# EAGLE design OLED_Board (EAGLE 7.5.0)

## Sheet 1 of 2
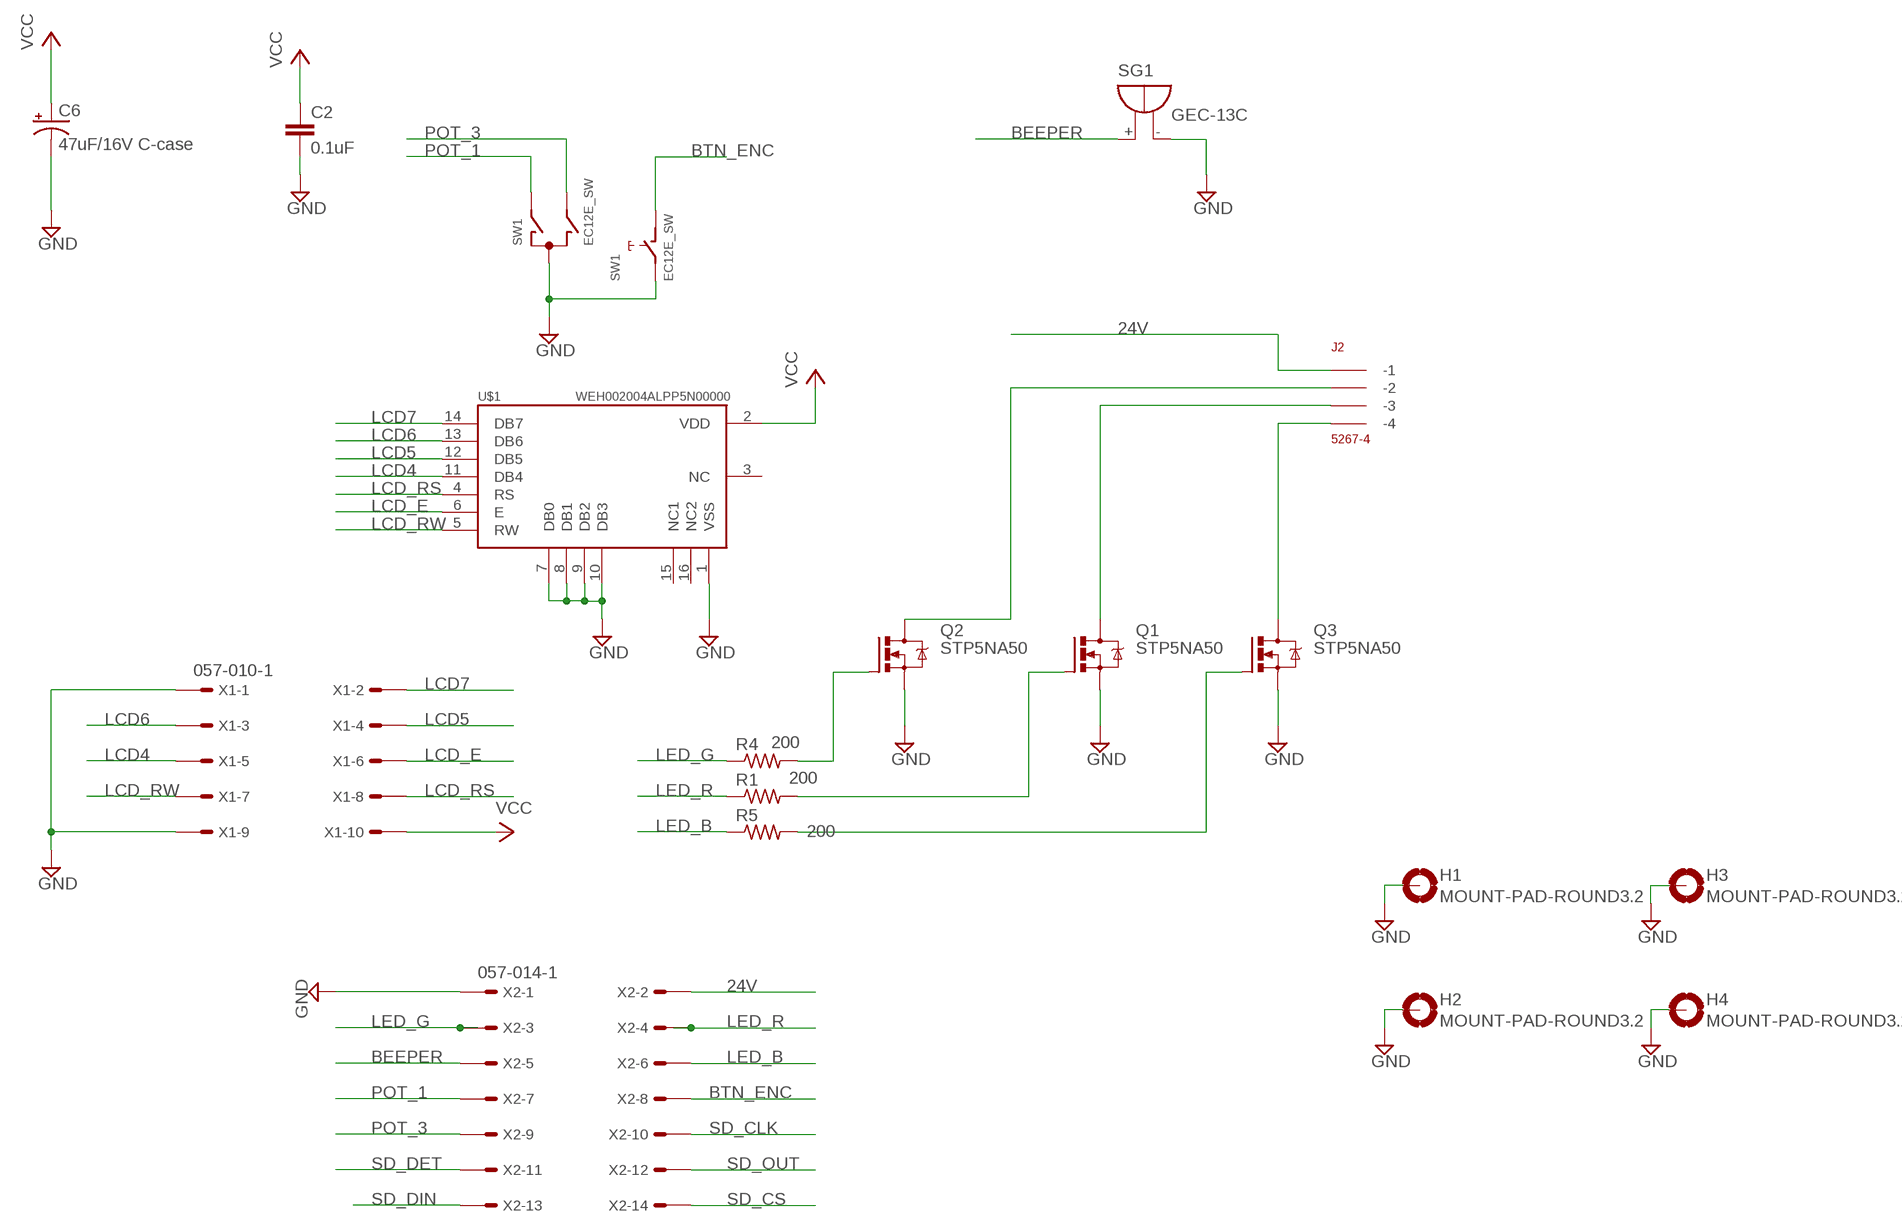
[diagram p0: schematic, sheet 1]

### Parts
C2  0.1uF  C-EUC0805  [C0805]
C6  47uF/16V C-case  CAP_POL6032  [EIA6032]
H1  MOUNT-PAD-ROUND3.2  [3,2-PAD]
H2  MOUNT-PAD-ROUND3.2  [3,2-PAD]
H3  MOUNT-PAD-ROUND3.2  [3,2-PAD]
H4  MOUNT-PAD-ROUND3.2  [3,2-PAD]
J2  5267-4  [5267-4]
Q1  STP5NA50  [TO220BV]
Q2  STP5NA50  [TO220BV]
Q3  STP5NA50  [TO220BV]
R1  200  R-US_R2012  [R2012]
R4  200  R-US_R2012  [R2012]
R5  200  R-US_R2012  [R2012]
SG1  GEC-13C  F/TMB  [F/TMB]
SW1  EC12E_SW  [ALPS_EC12E_SW]
U$1  OLED  [WEH002004ALPP5N00000]
X1  057-010-1  [057-010-1]
X2  057-014-1  [057-014-1]

### Nets
24V: J2.P$1(-1) X2.2
BEEPER: SG1.+ X2.5
BTN_ENC: SW1.D X2.8
GND: C2.2 C6.P$2(-) H1.B3,2(MOUNT) H2.B3,2(MOUNT) H3.B3,2(MOUNT) H4.B3,2(MOUNT) Q1.S Q2.S Q3.S SG1.- SW1.C SW1.E U$1.1(VSS) U$1.7(DB0) U$1.8(DB1) U$1.9(DB2) U$1.10(DB3) X1.1 X1.9 X2.1 ; also sheet 2
LCD4: U$1.11(DB4) X1.5
LCD5: U$1.12(DB5) X1.4
LCD6: U$1.13(DB6) X1.3
LCD7: U$1.14(DB7) X1.2
LCD_E: U$1.6(E) X1.6
LCD_RS: U$1.4(RS) X1.8
LCD_RW: U$1.5(RW) X1.7
LED_B: R5.1 X2.6
LED_G: R4.1 X2.3
LED_R: R1.1 X2.4
N$4: Q2.G R4.2
N$5: Q1.G R1.2
N$6: Q3.G R5.2
N$7: J2.P$2(-2) Q2.D
N$8: J2.P$3(-3) Q1.D
N$9: J2.P$4(-4) Q3.D
POT_1: SW1.A X2.7
POT_3: SW1.B X2.9
SD_CLK: X2.10 ; also sheet 2
SD_CS: X2.14 ; also sheet 2
SD_DET: X2.11 ; also sheet 2
SD_DIN: X2.13 ; also sheet 2
SD_OUT: X2.12 ; also sheet 2
VCC: C2.1 C6.P$1(+) U$1.2(VDD) X1.10 ; also sheet 2
Unconnected: SW1.GND1(G) SW1.GND2(G) U$1.3(NC) U$1.15(NC1) U$1.16(NC2)

## Sheet 2 of 2
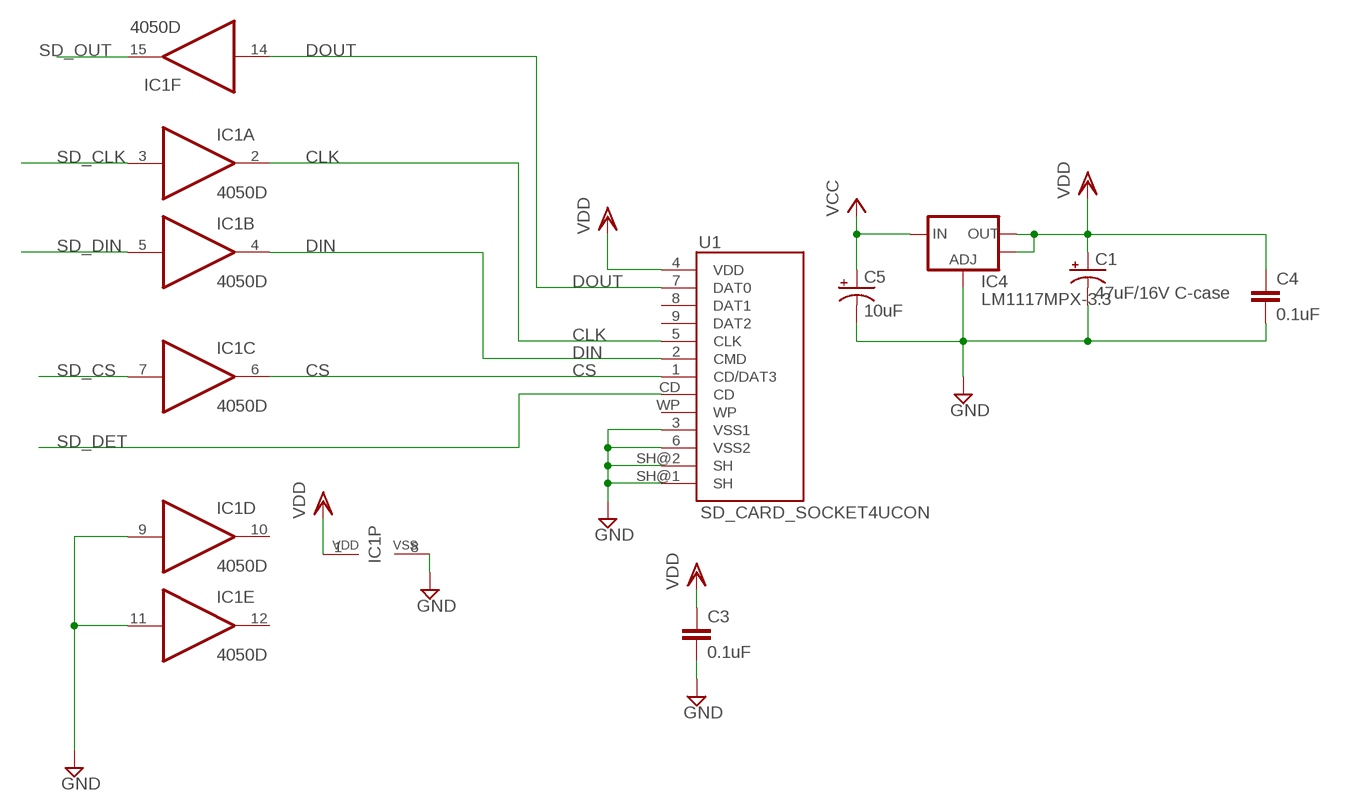
[diagram p1: schematic, sheet 2]

### Parts
C1  47uF/16V C-case  CAP_POL6032  [EIA6032]
C3  0.1uF  C-EUC0805  [C0805]
C4  0.1uF  C-EUC0805  [C0805]
C5  10uF  CPOL-USCT3216  [CT3216]
IC1  4050D  [SO16]
IC4  LM1117MPX-3.3  V_REG_LM1117SOT223  [SOT223]
U1  SD_CARD_SOCKET4UCON  [SDCARD_4UCONN]

### Nets
CLK: IC1.2(A:O) U1.5(CLK)
CS: IC1.6(C:O) U1.1(CD/DAT3)
DIN: IC1.4(B:O) U1.2(CMD)
DOUT: IC1.14(F:I) U1.7(DAT0)
GND: C1.P$2(-) C3.2 C4.2 C5.- IC1.8(P:VSS) IC1.9(D:I) IC1.11(E:I) IC4.1(ADJ) U1.3(VSS1) U1.6(VSS2) U1.SH@1(SH) U1.SH@2(SH) ; also sheet 1
SD_CLK: IC1.3(A:I) ; also sheet 1
SD_CS: IC1.7(C:I) ; also sheet 1
SD_DET: U1.CD ; also sheet 1
SD_DIN: IC1.5(B:I) ; also sheet 1
SD_OUT: IC1.15(F:O) ; also sheet 1
VCC: C5.+ IC4.3(IN) ; also sheet 1
VDD: C1.P$1(+) C3.1 C4.1 IC1.1(P:VDD) IC4.2(OUT) IC4.4(OUT) U1.4(VDD)
Unconnected: IC1.10(D:O) IC1.12(E:O) U1.8(DAT1) U1.9(DAT2) U1.WP

## Library data of the parts
C1 C6 = SparkFun:CAP_POL: Capacitor Polarized These are standard SMD and PTH capacitors. Normally 10uF, 47uF, and 100uF in electrolytic and tantalum varieties. Always verify the external diameter of the through hole cap, it varies with capacity, voltage, and manufacturer. The EIA devices should be standard.
C2 = rcl:C-EU: CAPACITOR, European symbol
C3 C4 = resistor:C-EU: CAPACITOR, European symbol
C5 = resistor:CPOL-US: POLARIZED CAPACITOR, American symbol
H1-H4 = holes:MOUNT-PAD-ROUND: MOUNTING PAD, round
IC1 = 40xx:4050: Hex non-inverting BUFFER
IC4 = SparkFun:V_REG_LM1117: Voltage Regulator LM1117 Standard adjustable voltage regulator but in SMD form. Spark Fun Electronics SKU : COM-00595
J2 = con-molex-spox:5267-4
Q1-Q3 = transistor-power:STP5NA50: N-CHANNEL MOS FET
R1 R4 R5 = rcl:R-US_: RESISTOR, American symbol
SG1 = buzzer:F/TMB: BUZZER Source: Buerklin; OC_FARNELL: unknown; OC_NEWARK: unknown
SW1 = switch-alps:EC12E_SW: ALPS rotary Encoder EC12E series with switch; MPN: EC12E2424407; OC_FARNELL: 1520813; OC_NEWARK: 74M1068
U1 = SparkFun-Connectors:SD_CARD_SOCKET: SD Memory Card Connector, push-push normal type, CD enable, WP enable
U$1 = OLED:OLED
X1 = con-panduit:057-010-: CONNECTOR 10-pin series 057 contact pc board low profile headers; OC_FARNELL: unknown; OC_NEWARK: unknown
X2 = con-panduit:057-014-: CONNECTOR 10-pin series 057 contact pc board low profile headers; OC_FARNELL: unknown; OC_NEWARK: unknown

## Board
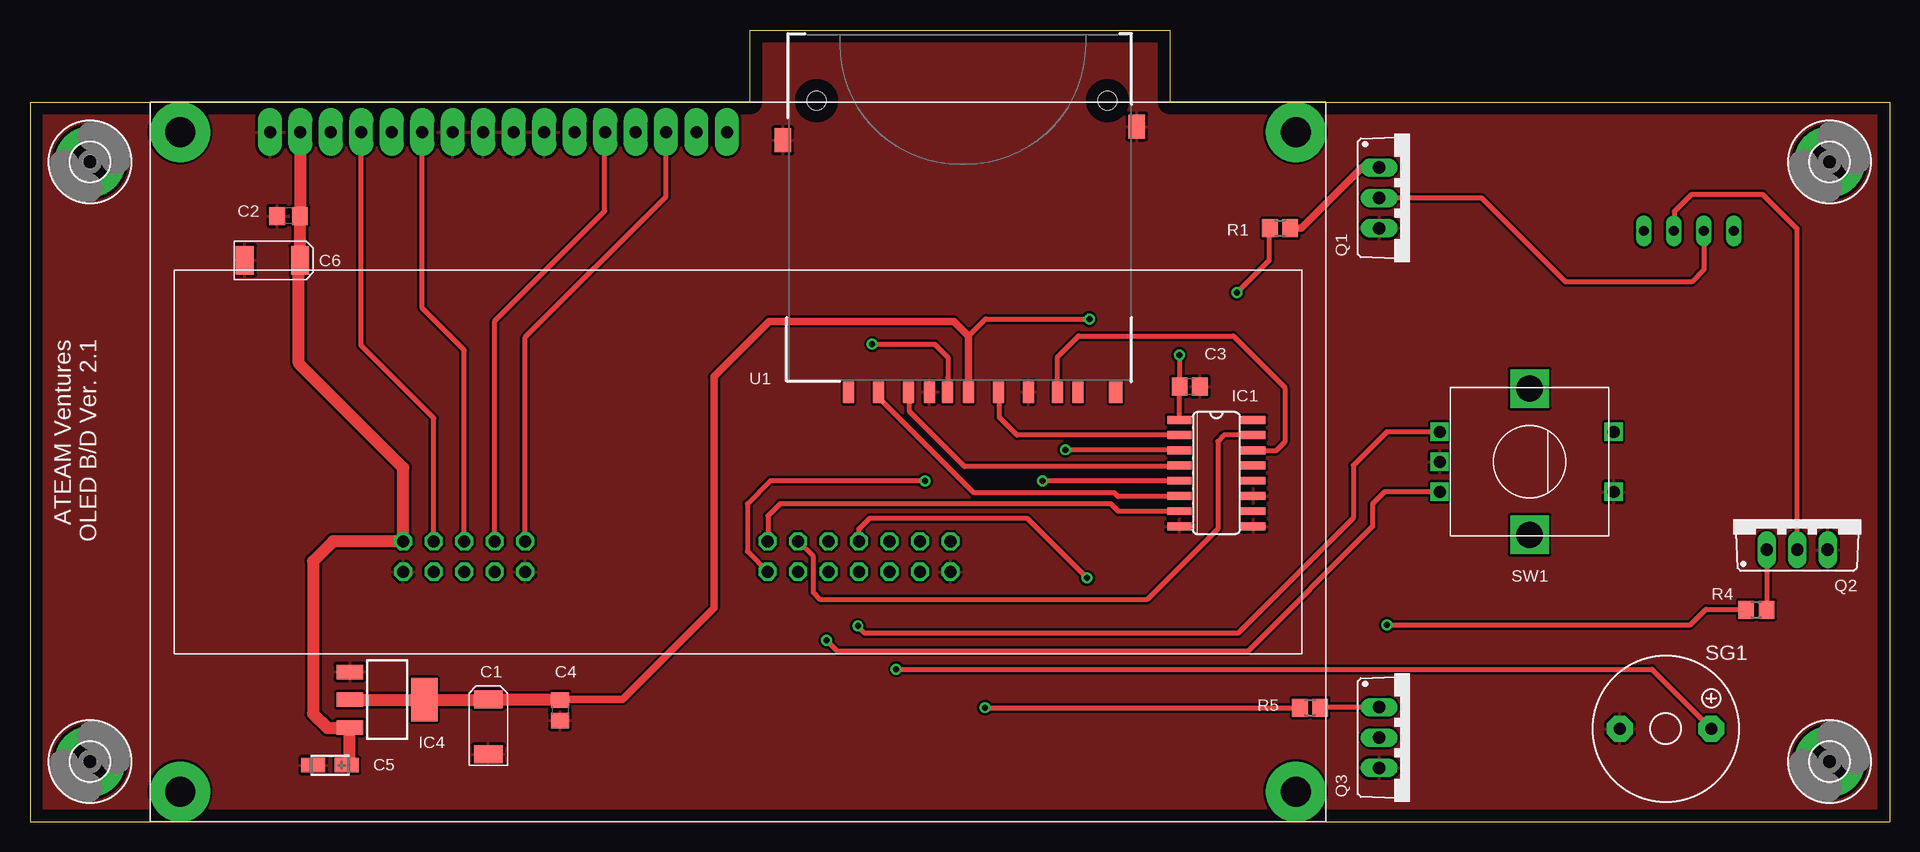
[diagram p2: board, top side]
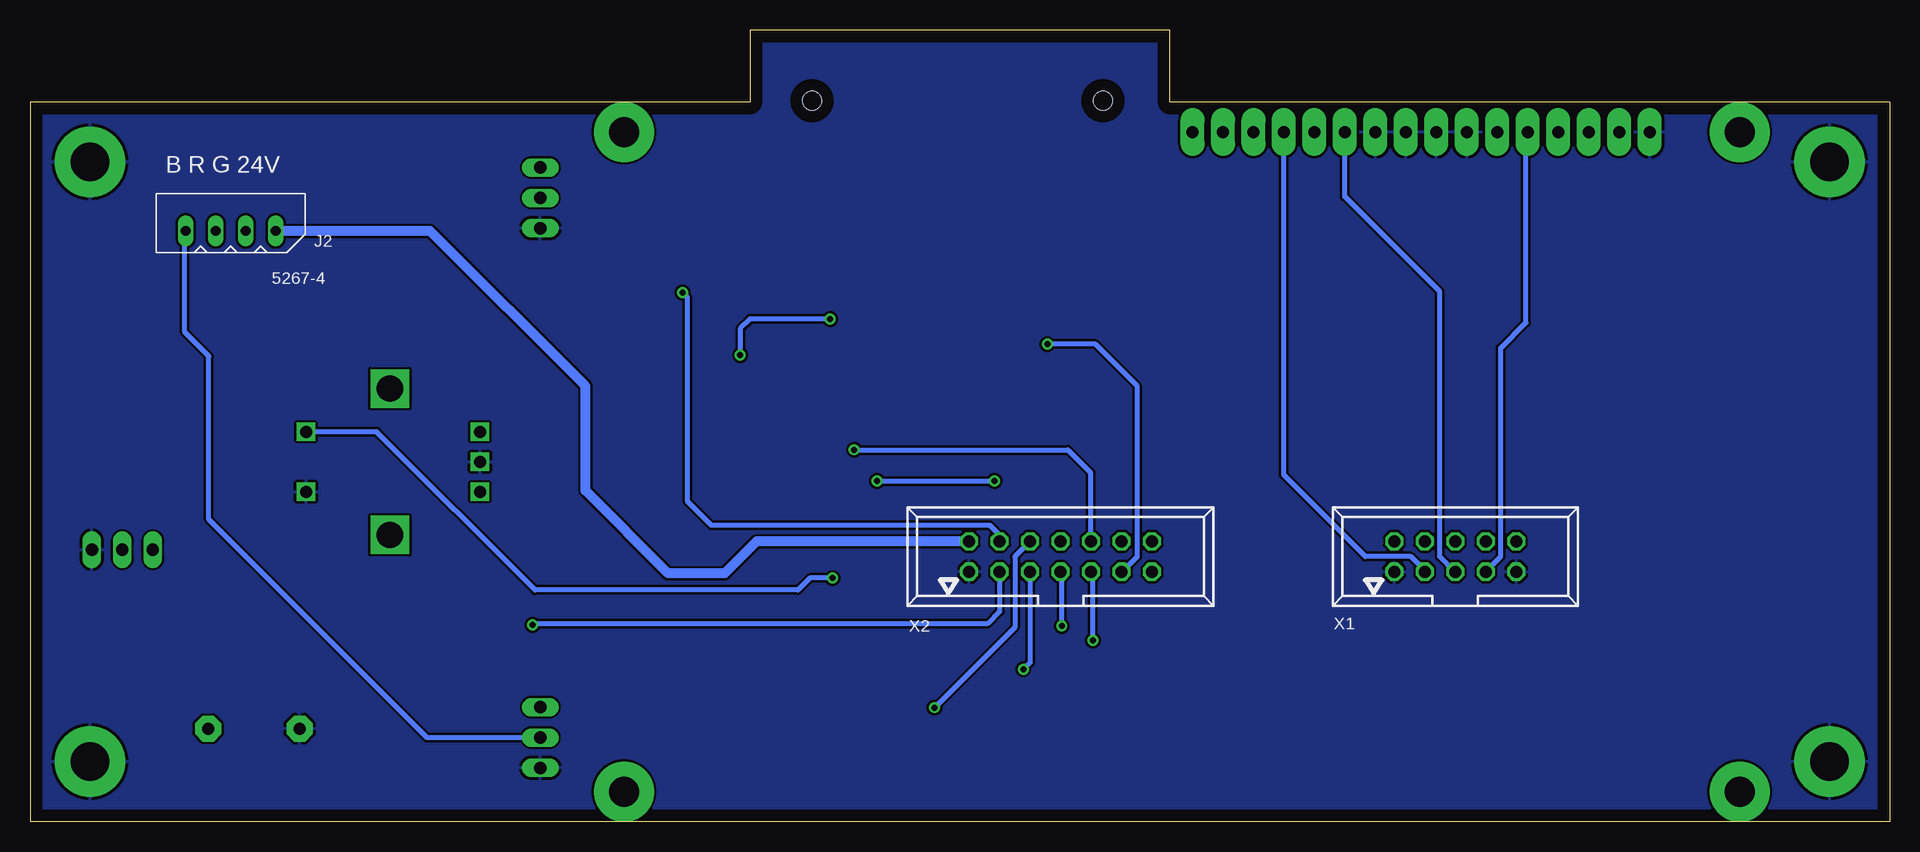
[diagram p3: board, bottom side, seen from below]

Size 155 x 66 mm. Coordinates in mm from the lower left corner, seen from the top.
Outline: 0,0 155,0 155,60 95,60 95,66 60,66 60,60 0,60 0,0
Copper layers (1*16): Top 0.035mm / dielectric 1.5mm / Bottom 0.035mm
Design rules "default *": minimum track width 10mil, minimum drill 0.3mm, track to track 8mil, track to pad 8mil, pad to pad 8mil, via to via 8mil, smd to smd 8mil, copper to edge 40mil, drill to drill 8mil, minimum pad ring 10mil, minimum via ring 8mil, stop-mask expansion 4mil, vias tented up to drill 0mil, thermal gap 10mil

### Footprints (pad centres in the part's own frame; a part is rotated, then mirrored left to right if it is on the bottom)
EIA6032 = smd 1.5 x 2.4: P$1 -2.3,0; P$2 2.3,0
C0805 = smd 1.3 x 1.5: 1 -0.95,0; 2 0.95,0
C0805' = smd 1.3 x 1.5: 1 -0.85,0; 2 0.85,0
CT3216 = smd 2 x 1.2: + 1.4,0; - -1.4,0
3,2-PAD = drill 3.2 pad 5.842: B3,2 0,0
SO16 = smd 0.66 x 2.032: 1 -4.445,-3.073; 2 -3.175,-3.073; 3 -1.905,-3.073; 4 -0.635,-3.073; 5 0.635,-3.073; 6 1.905,-3.073; 7 3.175,-3.073; 8 4.445,-3.073; 9 4.445,3.073; 10 3.175,3.073; 11 1.905,3.073; 12 0.635,3.073; 13 -0.635,3.073; 14 -1.905,3.073; 15 -3.175,3.073; 16 -4.445,3.073
SOT223 = smd 1.219 x 2.235: 1 -2.311,-3.099; 2 0,-3.099; 3 2.311,-3.099 | smd 3.6 x 2.2: 4 0,3.099
5267-4 = drill 0.8 long: P$1 0,0; P$2 2.5,0; P$3 5,0; P$4 7.5,0
TO220BV = drill 1.016 long: D 0,-2.54; G -2.54,-2.54; S 2.54,-2.54
R2012 = smd 1.3 x 1.5: 1 -0.85,0; 2 0.85,0
F/TMB = drill 1.016 pad 2.159 octagon: + 3.81,0; - -3.81,0
ALPS_EC12E_SW = drill 1 square: A -2.5,-7.5; B 2.5,-7.5; C 0,-7.5; D -2.5,7; E 2.5,7 | drill 2.2 square: GND1 -6.1,0; GND2 6.1,0
SDCARD_4UCONN = smd 1.8 x 0.9: 1 -1,6.77; 2 -1,4.27; 3 -1,2.52; 4 -1,-0.73; 5 -1,-3.23; 6 -1,-5.73; 7 -1,-8.15; 8 -1,-9.85; 9 -1,9.27; CD -1,1.02 | smd 2 x 1.4: SH@1 20,14.75; SH@2 21.15,-14.75 | smd 1.8 x 1.1: WP -1,-13 | hole 1.55: 23.3,11.94; 23.3,-12.32
WEH002004ALPP5N00000 = drill 1 pad 2 long: 1 -39,27.5; 2 -36.46,27.5; 3 -33.92,27.5; 4 -31.38,27.5; 5 -28.84,27.5; 6 -26.3,27.5; 7 -23.76,27.5; 8 -21.22,27.5; 9 -18.68,27.5; 10 -16.14,27.5; 11 -13.6,27.5; 12 -11.06,27.5; 13 -8.52,27.5; 14 -5.98,27.5; 15 -3.44,27.5; 16 -0.9,27.5 | drill 2.5 pad 5: P$17 -46.5,27.5; P$18 -46.5,-27.5; P$19 46.5,-27.5; P$20 46.5,27.5
057-010-1 = drill 1 octagon: 1 -5.08,-1.27; 2 -5.08,1.27; 3 -2.54,-1.27; 4 -2.54,1.27; 5 0,-1.27; 6 0,1.27; 7 2.54,-1.27; 8 2.54,1.27; 9 5.08,-1.27; 10 5.08,1.27
057-014-1 = drill 1 octagon: 1 -7.62,-1.27; 2 -7.62,1.27; 3 -5.08,-1.27; 4 -5.08,1.27; 5 -2.54,-1.27; 6 -2.54,1.27; 7 0,-1.27; 8 0,1.27; 9 2.54,-1.27; 10 2.54,1.27; 11 5.08,-1.27; 12 5.08,1.27; 13 7.62,-1.27; 14 7.62,1.27

### Placement (x,y rotation side)
C1  38.2,7.9 270 top
C2  21.55,50.5 180 top
C3  0.1uF  [C0805']  96.67,36.29 0 top
C4  0.1uF  [C0805']  44.18,9.28 270 top
C5  25.01,4.7 0 top
C6  20.2,46.8 180 top
H1  5,55 0 top
H2  5,5 0 top
H3  150,5 0 top
H4  150,55 0 top
IC1  98.89,29.05 270 top
IC4  29.77,10.16 270 top
J2  134.52,49.25 180 bottom
Q1  115,52 270 top
Q2  147.3,25.2 0 top
Q3  115,7 270 top
R1  104.2,49.47 0 top
R4  143.9,17.67 0 top
R5  106.7,9.5 0 top
SG1  136.34,7.74 0 top
SW1  125,30 270 top
U1  77.5,36.8 90 top
U$1  59,30 0 top
X1  36.2,22.1 0 bottom
X2  69.1,22.1 0 bottom

### Tracks (layer width: path | path; a pad name or v marks a point on that pad's centre or on a via)
24V
  Bottom 0.813: X2.2 94.43,23.37 97.1,20.7 101.8,20.7 108.7,27.6 108.7,36.3 121.65,49.25 J2.P$1
BEEPER  (via drill 0.5)
  Top 0.406: v72.2,12.7 135.19,12.7 SG1.+
  Bottom 0.406: X2.5 71.64,13.26 v72.2,12.7
BTN_ENC  (via drill 0.5)
  Top 0.406: X2.8 69.1,24.4 70,25.3 83.1,25.3 v88.1,20.3
  Bottom 0.406: v88.1,20.3 90,20.3 91,19.3 112.9,19.3 126.1,32.5 SW1.D
CLK
  Top 0.406: IC1.2 82.28,32.23 80.8,33.7 80.8,35.73 U1.5
CS
  Top 0.406: IC1.6 95.77,27.1 90.7,27.1 90.4,27.4 78.7,27.4 70.73,35.37 U1.1
DIN
  Top 0.406: IC1.4 95.69,29.68 95.6,29.6 77.9,29.6 73.3,34.2 73.3,35.73 U1.2
DOUT
  Top 0.406: U1.7 85.65,38.75 87.4,40.5 100.3,40.5 104.6,36.2 104.6,31.66 103.9,30.95 IC1.14
GND
  pour Bottom: -0.5,-0.5 156,-0.5 156,68.5 -0.5,68.5
  pour Top: -0.5,-0.5 156,-0.5 156,68.5 -0.5,68.5
LCD4
  Bottom 0.406: X1.5 36.23,20.83 37.5,22.1 37.5,44.2 45.4,52.1 U$1.11
LCD5
  Top 0.406: X1.4 38.74,41.74 47.9,50.9 47.9,57.46 U$1.12
LCD6
  Bottom 0.406: X1.3 38.74,20.94 39.9,22.1 43.7,22.1 50.5,28.9 50.5,57.48 U$1.13
LCD7
  Top 0.406: X1.2 41.28,40.38 53,52.1 53,57.48 U$1.14
LCD_E
  Top 0.406: X1.6 36.2,39.3 32.7,42.8 U$1.6
LCD_RS
  Top 0.406: X1.8 33.66,33.64 27.6,39.7 27.6,57.48 U$1.4
LCD_RW
  Bottom 0.406: X1.7 32.4,22.1 32.4,39.5 30.3,41.6 30.3,57.36 U$1.5
LED_B  (via drill 0.5)
  Top 0.406: v79.6,9.5 R5.1
  Bottom 0.406: X2.6 72.9,22.1 72.9,16.2 v79.6,9.5
LED_G  (via drill 0.5)
  Top 0.406: v113.1,16.4 138.4,16.4 139.7,17.7 143.02,17.7 R4.1
  Bottom 0.406: X2.3 74.18,17.52 75.2,16.5 113,16.5 v113.1,16.4
LED_R  (via drill 0.5)
  Top 0.406: v100.6,44.1 103.3,46.8 103.3,49.42 R1.1
  Bottom 0.406: v100.6,44.1 100.2,43.7 100.2,26.7 98.2,24.7 75,24.7 74.18,23.88 X2.4
N$4
  Top 0.406: Q2.G R4.2
N$5
  Top 0.61: Q1.G 111.04,54.54 105.97,49.47 R1.2
N$6
  Top 0.406: Q3.G 107.59,9.54 R5.2
N$7
  Top 0.406: J2.P$2 137.1,49.17 137.1,50.9 138.5,52.3 144.4,52.3 147.3,49.4 Q2.D
N$8
  Top 0.406: J2.P$3 139.52,46.02 138.5,45 128,45 121,52 Q1.D
N$9
  Bottom 0.406: Q3.D 121.9,7 140.1,25.2 140.1,38.8 142.1,40.8 142.1,49.17 J2.P$4
POT_1  (via drill 0.5)
  Top 0.406: SW1.A 113.1,32.5 110.3,29.7 110.3,25.3 100.7,15.7 69.6,15.7 v69,16.3
  Bottom 0.406: v69,16.3 69,20.73 X2.7
POT_3  (via drill 0.5)
  Top 0.406: SW1.B 112.9,27.5 111.9,26.5 111.9,24.6 101.5,14.2 67.3,14.2 v66.4,15.1
  Bottom 0.406: v66.4,15.1 66.4,20.67 X2.9
SD_CLK  (via drill 0.5)
  Top 0.406: IC1.3 95.82,31 v86.3,31
  Bottom 0.406: v86.3,31 68.5,31 66.6,29.1 66.6,23.41 X2.10
SD_CS
  Top 0.406: IC1.7 90.72,25.88 90.1,26.5 62.5,26.5 61.5,25.5 61.5,23.39 X2.14
SD_DET  (via drill 0.5)
  Top 0.406: v70.2,39.8 75.4,39.8 76.5,38.7 76.5,37.02 U1.CD
  Bottom 0.406: X2.11 63.97,20.83 62.7,22.1 62.7,36.3 66.2,39.8 v70.2,39.8
SD_DIN  (via drill 0.5)
  Top 0.406: IC1.5 v84.4,28.4 | v74.6,28.4 61.7,28.4 59.8,26.5 59.8,22.51 X2.13
  Bottom 0.406: v84.4,28.4 v74.6,28.4
SD_OUT
  Top 0.406: IC1.15 99.53,32.23 99,31.7 99,24.4 93.1,18.5 65.9,18.5 65.3,19.1 65.3,22.09 X2.12
VCC
  Top 0.406: 22.4,46.7 C6.P$1 | 22.54,50.54 C2.1 | 26.62,7.8 IC4.3 | 26.62,4.91 C5.+
  Top 1.016: 22.4,46.7 22.4,38.2 31.12,29.48 X1.10 25.27,23.37 23.6,21.7 23.6,9 24.8,7.8 26.62,7.8 26.62,4.91 | C6.P$1 C2.1 | U$1.2 22.54,50.54
VDD  (via drill 0.5)
  Top 0.406: 38.16,10.16 C1.P$1 | 44.11,10.2 C4.1 44.25,10.2 | IC1.1 95.82,36.99 C3.1 95.8,37.01 v95.8,38.9 | v88.3,41.9 79.66,41.9 78.23,40.47
  Top 0.61: 44.25,10.2 49.4,10.2 57,17.8 57,37.1 61.6,41.7 77,41.7 78.23,40.47 U1.4
  Top 1.016: IC4.2 IC4.4 38.16,10.16 | C1.P$1 44.11,10.2
  Bottom 0.406: v88.3,41.9 95,41.9 95.8,41.1 v95.8,38.9

### Text on the board
tNames: C6 | ATEAM Ventures / OLED B/D Ver. 2.1 | C1
bNames: B R G 24V